# EAGLE board interfacez_r2_2 (EAGLE 6.4), part 1 of 2
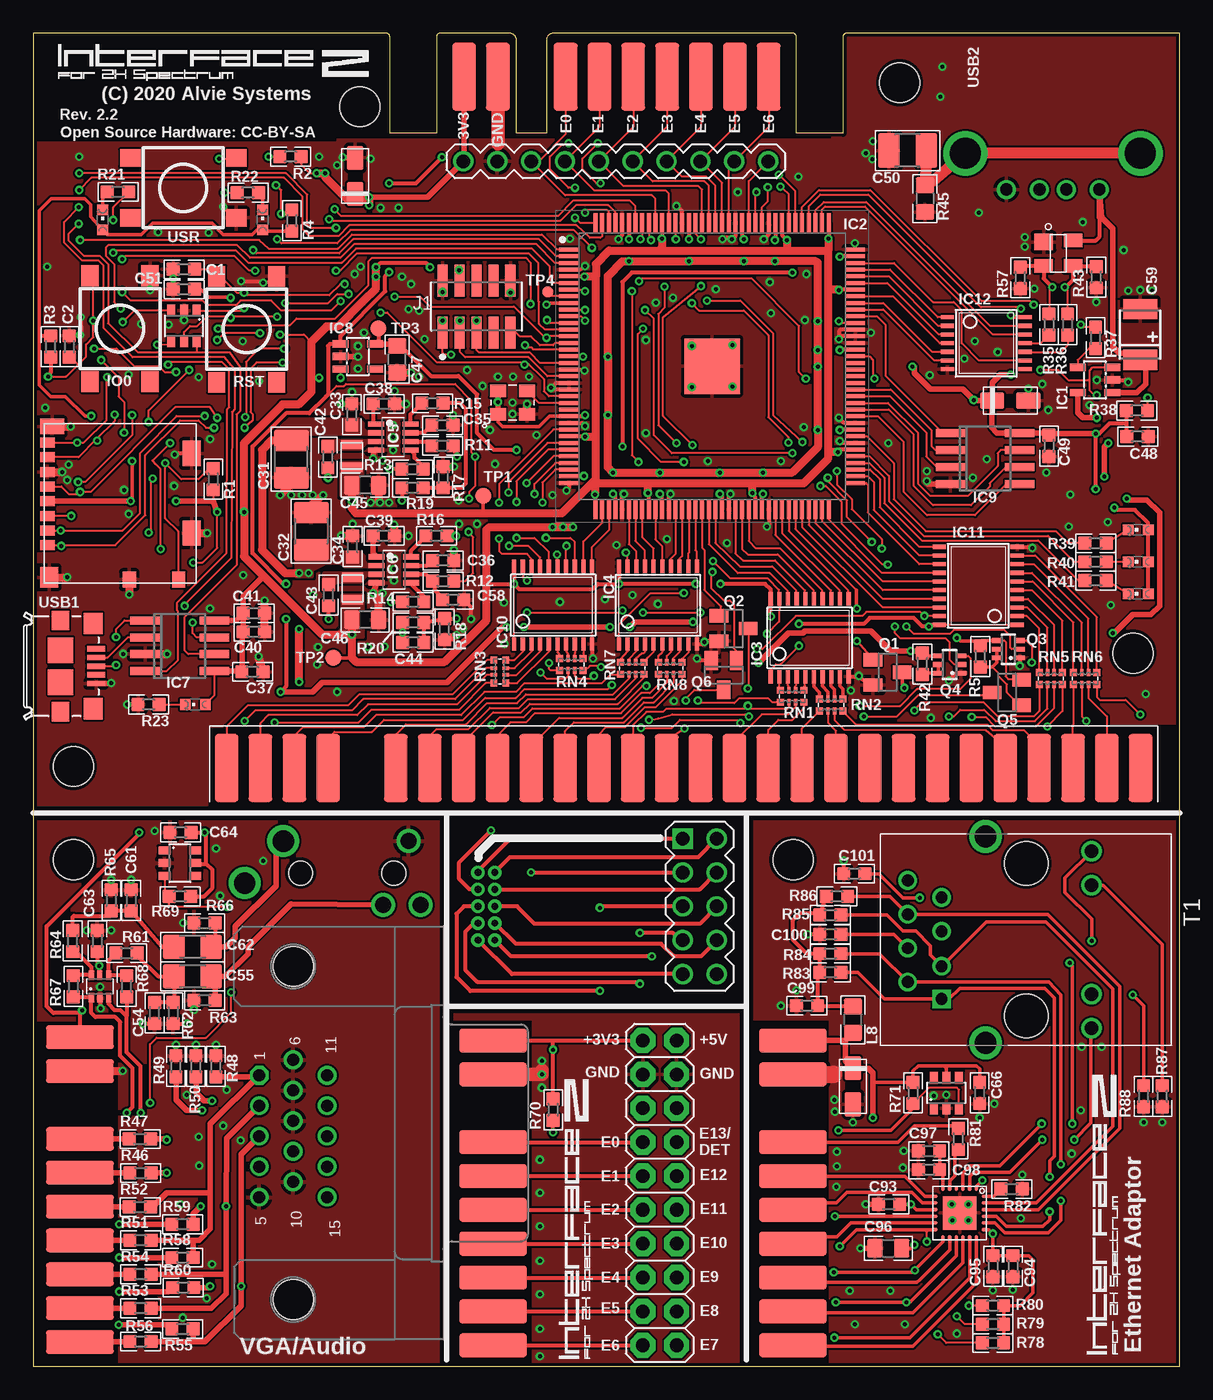
[diagram p9: board, top side]
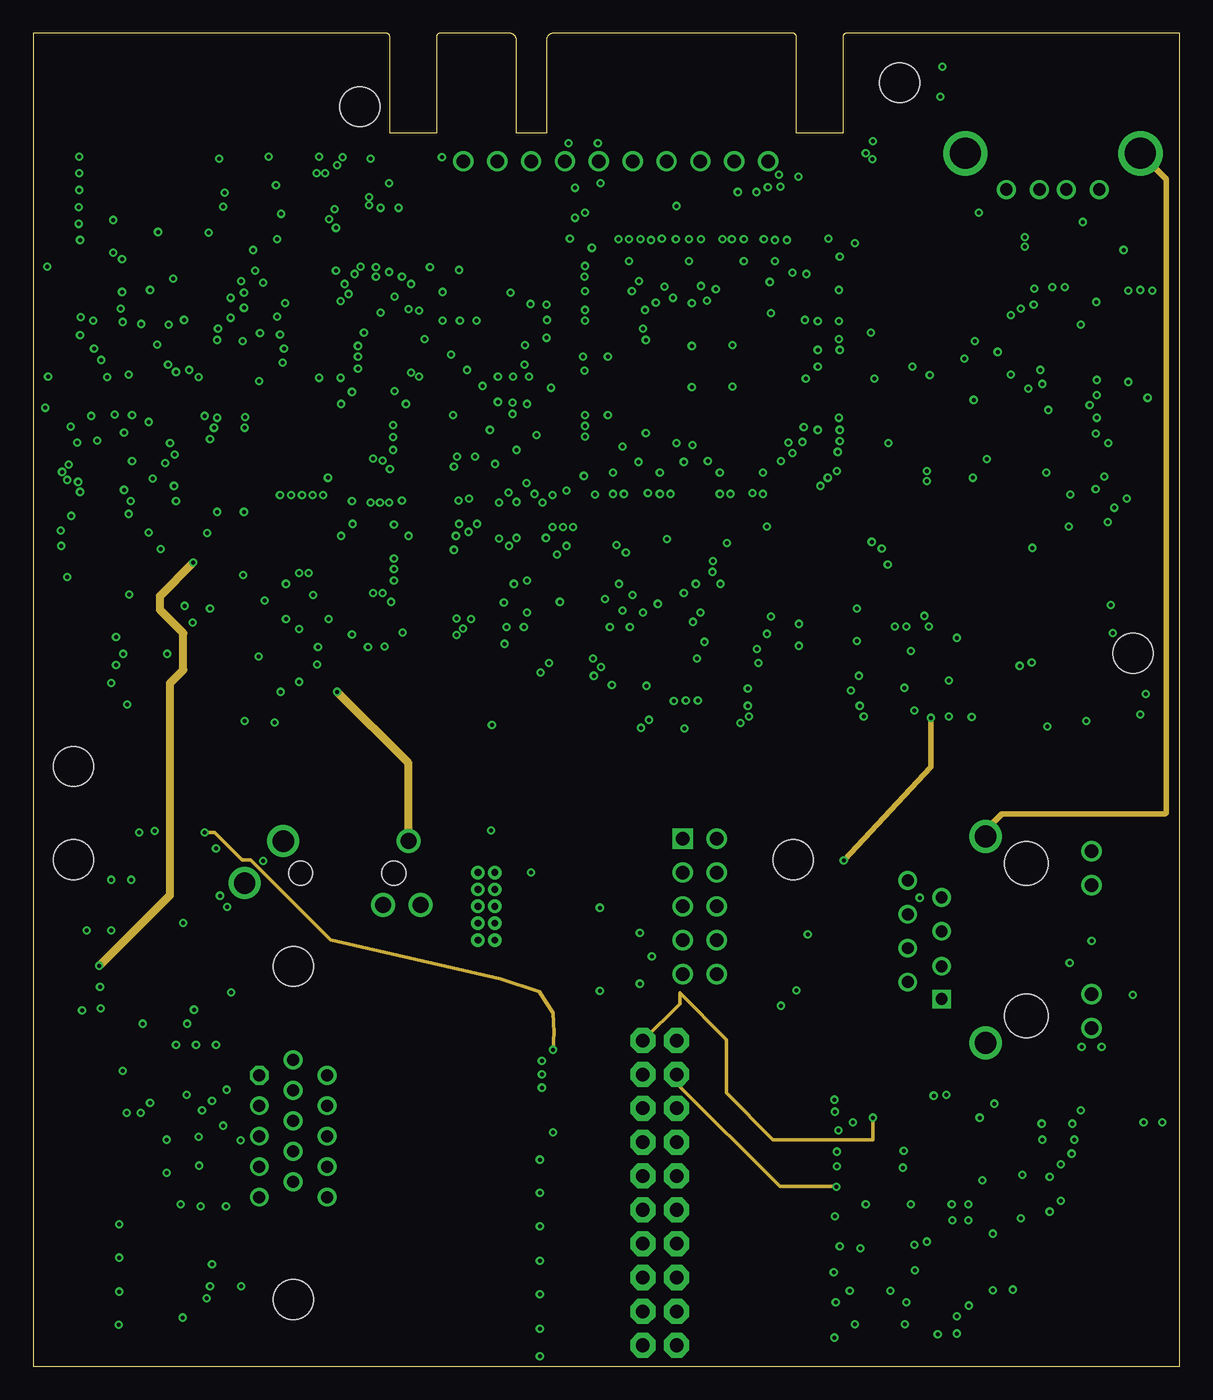
[diagram p10: board, inner layer Route2]
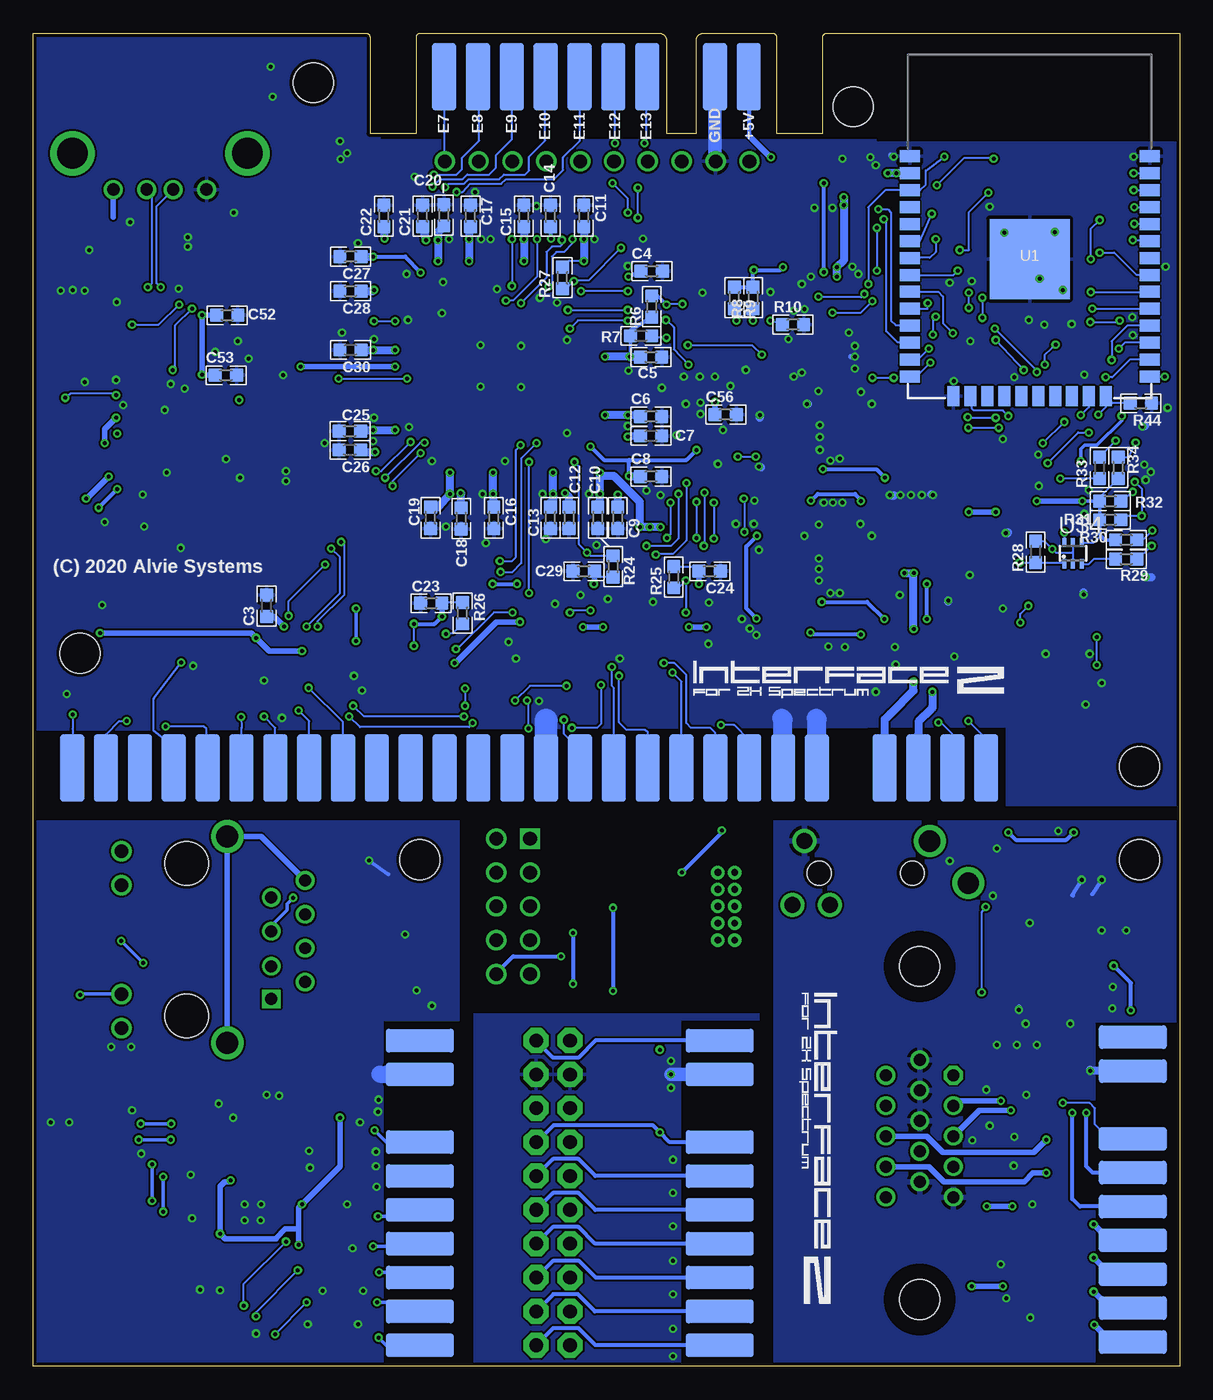
[diagram p11: board, bottom side, seen from below]

Size 86 x 100 mm. Coordinates in mm from the lower left corner, seen from the top.
Outline: 0,100 0,0 86,0 86,100 61,100 arc90 60.75,99.75 60.75,92.5 57.25,92.5 57.25,99.75 arc90 57,100 39,100 arc90 38.5,99.5 38.5,92.5 36.25,92.5 36.25,99.5 arc90 35.75,100 30.5,100 arc90 30.25,99.75 30.25,92.5 26.75,92.5 26.75,99.75 arc90 26.5,100 0,100
Copper layers (1*2*16): Top 0.035mm / dielectric 1.5mm / Route2 0.0175mm / dielectric 1.1mm / Bottom 0.035mm
Design rules "JLCPCB-Single-DualLayer *": minimum track width 5mil, minimum drill 0.3mm, track to track 6mil, track to pad 6mil, pad to pad 6mil, via to via 6mil, smd to smd 0mil, copper to edge 10mil, drill to drill 10mil, minimum pad ring 10mil, minimum via ring 6mil, stop-mask expansion 2mil, vias tented up to drill 100mil, thermal gap 10mil
Holes 3 mm at 3,45 82.5,53.5 24.5,94.5 65,96.3 3,38 57,38
tRestrict: area 30.5,0 to 31.5,41.5; area 0,41 to 86,42; area 30.5,0 to 31.5,41.5; area 53,0 to 54,41.5; area 31,26.5 to 53.5,27.5
bRestrict: area 30.5,0 to 31.5,41.5; area 0,41 to 86,42; area 30.5,0 to 31.5,41.5; area 53,0 to 54,41.5; area 31,26.5 to 53.5,27.5

## Footprints (pad centres in the part's own frame; a part is rotated, then mirrored left to right if it is on the bottom)
0603 = smd 1 x 1: 1 -0.8,0; 2 0.8,0
1210 = smd 1.6 x 2.6: 1 -1.4,0; 2 1.4,0
0805 = smd 1.2 x 1.4: 1 -1,0; 2 1,0
1206 = smd 1.6 x 1.8: 1 -1.4,0; 2 1.4,0
TANT_CASE_A = smd 1.8 x 1.23: MINUS 1.355,0; PLUS -1.355,0
TE-B-3528 = smd 1.524 x 2.54: + 1.905,0; - -1.905,0
ZX-EDGE-DAUGHTERBOARD = smd 1.778 x 5.08 bottom: A1 6.35,-1.27; A2 3.81,-1.27; A3 1.27,-1.27; A4 -1.27,-1.27; A6 -6.35,-1.27; A7 -8.89,-1.27; A8 -11.43,-1.27; A9 -13.97,-1.27; A10 -16.51,-1.27; A11 -19.05,-1.27; A12 -21.59,-1.27; A13 -24.13,-1.27; A14 -26.67,-1.27; A15 -29.21,-1.27; A16 -31.75,-1.27; A17 -34.29,-1.27; A18 -36.83,-1.27; A19 -39.37,-1.27; A20 -41.91,-1.27; A21 -44.45,-1.27; A22 -46.99,-1.27; A23 -49.53,-1.27; A24 -52.07,-1.27; A25 -54.61,-1.27; A26 -57.15,-1.27; A27 -59.69,-1.27; A28 -62.23,-1.27 | smd 1.778 x 5.08: B1 6.35,-1.27; B2 3.81,-1.27; B3 1.27,-1.27; B4 -1.27,-1.27; B6 -6.35,-1.27; B7 -8.89,-1.27; B8 -11.43,-1.27; B9 -13.97,-1.27; B10 -16.51,-1.27; B11 -19.05,-1.27; B12 -21.59,-1.27; B13 -24.13,-1.27; B14 -26.67,-1.27; B15 -29.21,-1.27; B16 -31.75,-1.27; B17 -34.29,-1.27; B18 -36.83,-1.27; B19 -39.37,-1.27; B20 -41.91,-1.27; B21 -44.45,-1.27; B22 -46.99,-1.27; B23 -49.53,-1.27; B24 -52.07,-1.27; B25 -54.61,-1.27; B26 -57.15,-1.27; B27 -59.69,-1.27; B28 -62.23,-1.27
SOT23-5L = smd 0.55 x 1.2: 1 -0.95,-1.3; 2 0,-1.3; 3 0.95,-1.3; 4 0.95,1.3; 5 -0.95,1.3
QFP50P2200X2200X165-145N = smd 1.475 x 0.3: 1 -10.738,8.75; 2 -10.738,8.25; 3 -10.738,7.75; 4 -10.738,7.25; 5 -10.738,6.75; 6 -10.738,6.25; 7 -10.738,5.75; 8 -10.738,5.25; 9 -10.738,4.75; 10 -10.738,4.25; 11 -10.738,3.75; 12 -10.738,3.25; 13 -10.738,2.75; 14 -10.738,2.25; 15 -10.738,1.75; 16 -10.738,1.25; 17 -10.738,0.75; 18 -10.738,0.25; 19 -10.738,-0.25; 20 -10.738,-0.75; 21 -10.738,-1.25; 22 -10.738,-1.75; 23 -10.738,-2.25; 24 -10.738,-2.75; 25 -10.738,-3.25; 26 -10.738,-3.75; 27 -10.738,-4.25; 28 -10.738,-4.75; 29 -10.738,-5.25; 30 -10.738,-5.75; 31 -10.738,-6.25; 32 -10.738,-6.75; 33 -10.738,-7.25; 34 -10.738,-7.75; 35 -10.738,-8.25; 36 -10.738,-8.75; 73 10.738,-8.75; 74 10.738,-8.25; 75 10.738,-7.75; 76 10.738,-7.25; 77 10.738,-6.75; 78 10.738,-6.25; 79 10.738,-5.75; 80 10.738,-5.25; 81 10.738,-4.75; 82 10.738,-4.25; 83 10.738,-3.75; 84 10.738,-3.25; 85 10.738,-2.75; 86 10.738,-2.25; 87 10.738,-1.75; 88 10.738,-1.25; 89 10.738,-0.75; 90 10.738,-0.25; 91 10.738,0.25; 92 10.738,0.75; 93 10.738,1.25; 94 10.738,1.75; 95 10.738,2.25; 96 10.738,2.75; 97 10.738,3.25; 98 10.738,3.75; 99 10.738,4.25; 100 10.738,4.75; 101 10.738,5.25; 102 10.738,5.75; 103 10.738,6.25; 104 10.738,6.75; 105 10.738,7.25; 106 10.738,7.75; 107 10.738,8.25; 108 10.738,8.75 | smd 0.3 x 1.475: 37 -8.75,-10.738; 38 -8.25,-10.738; 39 -7.75,-10.738; 40 -7.25,-10.738; 41 -6.75,-10.738; 42 -6.25,-10.738; 43 -5.75,-10.738; 44 -5.25,-10.738; 45 -4.75,-10.738; 46 -4.25,-10.738; 47 -3.75,-10.738; 48 -3.25,-10.738; 49 -2.75,-10.738; 50 -2.25,-10.738; 51 -1.75,-10.738; 52 -1.25,-10.738; 53 -0.75,-10.738; 54 -0.25,-10.738; 55 0.25,-10.738; 56 0.75,-10.738; 57 1.25,-10.738; 58 1.75,-10.738; 59 2.25,-10.738; 60 2.75,-10.738; 61 3.25,-10.738; 62 3.75,-10.738; 63 4.25,-10.738; 64 4.75,-10.738; 65 5.25,-10.738; 66 5.75,-10.738; 67 6.25,-10.738; 68 6.75,-10.738; 69 7.25,-10.738; 70 7.75,-10.738; 71 8.25,-10.738; 72 8.75,-10.738; 109 8.75,10.738; 110 8.25,10.738; 111 7.75,10.738; 112 7.25,10.738; 113 6.75,10.738; 114 6.25,10.738; 115 5.75,10.738; 116 5.25,10.738; 117 4.75,10.738; 118 4.25,10.738; 119 3.75,10.738; 120 3.25,10.738; 121 2.75,10.738; 122 2.25,10.738; 123 1.75,10.738; 124 1.25,10.738; 125 0.75,10.738; 126 0.25,10.738; 127 -0.25,10.738; 128 -0.75,10.738; 129 -1.25,10.738; 130 -1.75,10.738; 131 -2.25,10.738; 132 -2.75,10.738; 133 -3.25,10.738; 134 -3.75,10.738; 135 -4.25,10.738; 136 -4.75,10.738; 137 -5.25,10.738; 138 -5.75,10.738; 139 -6.25,10.738; 140 -6.75,10.738; 141 -7.25,10.738; 142 -7.75,10.738; 143 -8.25,10.738; 144 -8.75,10.738 | smd 4.15 x 4.15: 145 0,0
TSSOP20 = smd 0.305 x 0.991: 1 -2.925,-2.918; 2 -2.275,-2.918; 3 -1.625,-2.918; 4 -0.975,-2.918; 5 -0.325,-2.918; 6 0.325,-2.918; 7 0.975,-2.918; 8 1.625,-2.918; 9 2.275,-2.918; 10 2.925,-2.918; 11 2.925,2.918; 12 2.275,2.918; 13 1.625,2.918; 14 0.975,2.918; 15 0.325,2.918; 16 -0.325,2.918; 17 -0.975,2.918; 18 -1.625,2.918; 19 -2.275,2.918; 20 -2.925,2.918
SOT23-8L = smd 0.4 x 1.2: 1 -0.975,-1.3; 2 -0.325,-1.3; 3 0.325,-1.3; 4 0.975,-1.3; 5 0.975,1.3; 6 0.325,1.3; 7 -0.325,1.3; 8 -0.975,1.3
SOIC8 = smd 0.6 x 2.2: 1 -1.905,-2.6; 2 -0.635,-2.6; 3 0.635,-2.6; 4 1.905,-2.6; 5 1.905,2.6; 6 0.635,2.6; 7 -0.635,2.6; 8 -1.905,2.6
TSSOP14 = smd 0.305 x 0.991: 1 -1.95,-2.918; 2 -1.3,-2.918; 3 -0.65,-2.918; 4 0,-2.918; 5 0.65,-2.918; 6 1.3,-2.918; 7 1.95,-2.918; 8 1.95,2.918; 9 1.3,2.918; 10 0.65,2.918; 11 0,2.918; 12 -0.65,2.918; 13 -1.3,2.918; 14 -1.95,2.918
SC70-6 = smd 0.4 x 0.7: 1 -0.65,-0.85; 2 0,-0.85; 3 0.65,-0.85; 4 0.65,0.85; 5 -0.015,0.85; 6 -0.65,0.85
QFN24_4MM_X_4MM = smd 0.4 x 0.25: 1 -1.86,1.25; 2 -1.86,0.75; 3 -1.86,0.25; 4 -1.86,-0.25; 5 -1.86,-0.75; 6 -1.86,-1.25; 13 1.86,-1.25; 14 1.86,-0.75; 15 1.86,-0.25; 16 1.86,0.25; 17 1.86,0.75; 18 1.86,1.25 | smd 0.25 x 0.4: 7 -1.25,-1.86; 8 -0.75,-1.86; 9 -0.25,-1.86; 10 0.25,-1.86; 11 0.75,-1.86; 12 1.25,-1.86; 19 1.25,1.86; 20 0.75,1.86; 21 0.25,1.86; 22 -0.25,1.86; 23 -0.75,1.86; 24 -1.25,1.86 | smd 2.5 x 2.5: P 0,0
AMPHENOL_ICC_-_FCI_20021121-00010C4LF_0 = smd 0.76 x 2.4: 1 -2.54,-1.95; 2 -2.54,1.95; 3 -1.27,-1.95; 4 -1.27,1.95; 5 0,-1.95; 6 0,1.95; 7 1.27,-1.95; 8 1.27,1.95; 9 2.54,-1.95; 10 2.54,1.95
2X10 = drill 1.016 pad 1.88 octagon: 1 -11.43,-1.27; 2 -11.43,1.27; 3 -8.89,-1.27; 4 -8.89,1.27; 5 -6.35,-1.27; 6 -6.35,1.27; 7 -3.81,-1.27; 8 -3.81,1.27; 9 -1.27,-1.27; 10 -1.27,1.27; 11 1.27,-1.27; 12 1.27,1.27; 13 3.81,-1.27; 14 3.81,1.27; 15 6.35,-1.27; 16 6.35,1.27; 17 8.89,-1.27; 18 8.89,1.27; 19 11.43,-1.27; 20 11.43,1.27
IND_0806 = smd 0.7 x 1.6: P$1 -0.85,0; P$2 0.85,0
LED-603 = smd 0.8 x 0.8: A 0,-0.75; C 0,0.75
SOT23 = smd 1 x 1.4: 1 -0.95,-1.1; 2 0.95,-1.1; 3 0,1.1
SC70-6' = smd 0.35 x 0.8: 1 -0.65,-0.85; 2 0,-0.85; 3 0.65,-0.85; 4 0.65,0.85; 5 0,0.85; 6 -0.65,0.85
EXB28V = smd 0.525 x 0.5: 1 -0.875,-0.45; 4 0.875,-0.45; 5 0.875,0.45; 8 -0.875,0.45 | smd 0.25 x 0.5: 2 -0.25,-0.45; 3 0.25,-0.45; 6 0.25,0.45; 7 -0.25,0.45
TACTILE_SWITCH_TALL = smd 1.55 x 1.3: A1 -3.975,-2.25; A2 3.975,-2.25; B1 -3.975,2.25; B2 3.975,2.25
1040310811 = smd 0.75 x 1.1: 1 3.155,-5.45; 2 2.055,-5.45; 3 0.955,-5.45; 4 -0.145,-5.45; 5 -1.245,-5.45; 6 -2.345,-5.45; 7 -3.445,-5.45; 8 -4.545,-5.45 | smd 1.2 x 1: A 5.74,4.4; B 5.74,0.7 | smd 1.9 x 1.35: MNT1 -3.73,5.375; MNT2 2.24,5.375 | smd 1.17 x 1.8: MNT3 -5.755,-5.1 | smd 1.55 x 1.35: MNT4 5.565,-5.325
HR13550A = drill 0.89 square: 1 4.45,-6.35 | drill 0.89: 2 3.18,-8.89; 3 2,-6.35; 4 0.64,-8.89; 5 -0.63,-6.35; 6 -1.9,-8.89; 7 -3.17,-6.35; 8 -4.44,-8.89 | drill 1.02: 9 6.625,4.9; 10 4.085,4.9; 11 -4.085,4.9; 12 -6.625,4.9 | drill 1.63: Z1 -7.745,-3.05; Z2 7.745,-3.05 | hole 3.25: -5.715,0; 5.715,0
TP12R = smd 1.2 x 1.2: TP 0,0
TP08R = smd 0.8 x 0.8: TP 0,0
SP0503 = smd 1.2 x 1.4: 1 -0.85,-1.1 | smd 1 x 1.4: 2 0.95,-1.1; 3 0.95,1.1; 4 -0.95,1.1
ESP-WROOM-32 = smd 0.9 x 1.5: 1 7.7,9; 2 6.43,9; 3 5.16,9; 4 3.89,9; 5 2.62,9; 6 1.35,9; 7 0.08,9; 8 -1.19,9; 9 -2.46,9; 10 -3.73,9; 11 -5,9; 12 -6.27,9; 13 -7.54,9; 14 -8.81,9; 25 -8.81,-9; 26 -7.54,-9; 27 -6.27,-9; 28 -5,-9; 29 -3.73,-9; 30 -2.46,-9; 31 -1.19,-9; 32 0.08,-9; 33 1.35,-9; 34 2.62,-9; 35 3.89,-9; 36 5.16,-9; 37 6.43,-9; 38 7.7,-9 | smd 1.5 x 0.9: 15 -10.3,5.715; 16 -10.3,4.445; 17 -10.3,3.175; 18 -10.3,1.905; 19 -10.3,0.635; 20 -10.3,-0.635; 21 -10.3,-1.905; 22 -10.3,-3.175; 23 -10.3,-4.445; 24 -10.3,-5.715 | smd 6 x 6: GND 0,0
KC3225K = smd 1.2 x 0.95: 1 -1.1,-0.875; 2 1.1,-0.875; 3 1.1,0.875; 4 -1.1,0.875
INTERFACEZ_EXPANSION_DAUGHTERCARD = smd 1.778 x 5.08 bottom: A1 11.43,0; A2 8.89,0; A4 3.81,0; A5 1.27,0; A6 -1.27,0; A7 -3.81,0; A8 -6.35,0; A9 -8.89,0; A10 -11.43,0 | smd 1.778 x 5.08: B1 11.43,0; B2 8.89,0; B4 3.81,0; B5 1.27,0; B6 -1.27,0; B7 -3.81,0; B8 -6.35,0; B9 -8.89,0; B10 -11.43,0
SOT23-6 = smd 0.6 x 0.9: 1 -0.95,-1.15; 2 0,-1.15; 3 0.95,-1.15; 4 0.95,1.15; 5 0,1.15; 6 -0.95,1.15
SOT363_INFINEON = smd 0.3 x 0.7: 1 -0.65,-0.8; 2 0,-0.8; 3 0.65,-0.8; 4 0.65,0.8; 5 0,0.8; 6 -0.65,0.8
PIN-1X10 = drill 1.016: 1 -11.43,0; 2 -8.89,0; 3 -6.35,0; 4 -3.81,0; 5 -1.27,0; 6 1.27,0; 7 3.81,0; 8 6.35,0; 9 8.89,0; 10 11.43,0
PJ328A0 = drill 1.2: 1 -4.95,-2.4; 3 -3.05,2.4; 11 -5.85,2.4 | drill 1.6: 2 4.45,-2.4; 10 7.35,0.75 | hole 1.8: -3.85,0; 3.15,0
PIN-2X5-1.27 = drill 0.5: 1 -2.54,-0.635; 2 -2.54,0.635; 3 -1.27,-0.635; 4 -1.27,0.635; 5 0,-0.635; 6 0,0.635; 7 1.27,-0.635; 8 1.27,0.635; 9 2.54,-0.635; 10 2.54,0.635
PIN-2X5 = drill 1.016 square: 1 -5.08,-1.27 | drill 1.016: 2 -5.08,1.27; 3 -2.54,-1.27; 4 -2.54,1.27; 5 0,-1.27; 6 0,1.27; 7 2.54,-1.27; 8 2.54,1.27; 9 5.08,-1.27; 10 5.08,1.27
CONN_USB_MICRO-B = smd 1.6 x 1.4: BODY@1 -3.2,2.45; BODY@2 3.2,2.45 | smd 1.45 x 1.3: BODY@3 3.425,0; BODY@6 -3.425,0 | smd 1.9 x 1.9: BODY@4 1.2,0; BODY@5 -1.2,0 | smd 0.4 x 1.35: P1 -1.3,2.675; P2 -0.65,2.675; P3 0,2.675; P4 0.65,2.675; P5 1.3,2.675
USB-A-H = drill 0.914: D+ 2.718,-1.003; D- 2.718,1.003; GND 2.718,-3.493; VBUS 2.718,3.493 | drill 2.311: P$5 0,-6.566; P$6 0,6.566
HDF15H = drill 0.9 octagon: 1 4.329,2.54 | drill 0.9: 2 2.043,2.54; 3 -0.243,2.54; 4 -2.529,2.54; 5 -4.815,2.54; 6 5.472,0; 7 3.186,0; 8 0.9,0; 9 -1.386,0; 10 -3.672,0; 11 4.329,-2.54; 12 2.043,-2.54; 13 -0.243,-2.54; 14 -2.529,-2.54; 15 -4.815,-2.54 | hole 3: -12.5,0; 12.5,0

## Placement (x,y rotation side)
C1  1nF  [0603]  11.3,82.3 0 top
C2  1nF  [0603]  2.7,76.5 270 top
C3  100nF 6.3V  [0603]  68.5,57.05 90 bottom
C4  100nF 6.3V  [0603]  39.6,82.15 0 bottom
C5  100nF 6.3V  [0603]  39.65,75.7 0 bottom
C6  100nF 6.3V  [0603]  39.65,71.25 0 bottom
C7  100nF 6.3V  [0603]  39.65,69.8 0 bottom
C8  100nF 6.3V  [0603]  39.65,66.75 0 bottom
C9  100nF 6.3V  [0603]  42.15,63.65 270 bottom
C10  100nF 6.3V  [0603]  43.65,63.65 270 bottom
C11  100nF 6.3V  [0603]  44.7,86.3 90 bottom
C12  100nF 6.3V  [0603]  45.8,63.65 270 bottom
C13  100nF 6.3V  [0603]  47.2,63.65 270 bottom
C14  100nF 6.3V  [0603]  47.2,86.3 90 bottom
C15  100nF 6.3V  [0603]  49.2,86.3 90 bottom
C16  100nF 6.3V  [0603]  51.45,63.65 270 bottom
C17  100nF 6.3V  [0603]  53.2,86.3 90 bottom
C18  100nF 6.3V  [0603]  53.9,63.6 270 bottom
C19  100nF 6.3V  [0603]  56.2,63.65 270 bottom
C20  100nF 6.3V  [0603]  55.2,86.35 90 bottom
C21  100nF 6.3V  [0603]  56.8,86.3 90 bottom
C22  100nF 6.3V  [0603]  59.7,86.3 90 bottom
C23  100nF 6.3V  [0603]  56.15,57.25 180 bottom
C24  100nF 6.3V  [0603]  35.25,59.65 0 bottom
C25  100nF 6.3V  [0603]  62.25,70.15 180 bottom
C26  100nF 6.3V  [0603]  62.25,68.75 180 bottom
C27  100nF 6.3V  [0603]  62.2,83.25 180 bottom
C28  100nF 6.3V  [0603]  62.2,80.65 180 bottom
C29  100nF 6.3V  [0603]  44.7,59.65 180 bottom
C30  100nF 6.3V  [0603]  62.2,76.25 180 bottom
C31  22uF 16V  [1210]  19.35,68.05 90 top
C32  22uF 16V  [1210]  20.85,62.65 270 top
C33  100nF 16V  [0603]  23.9,71.4 270 top
C34  100nF 16V  [0603]  23.95,61.5 270 top
C35  100nF 16V  [0603]  30.7,70.6 180 top
C36  100nF 16V  [0603]  30.75,60.45 180 top
C37  1uF  [0603]  16.45,52.1 0 top
C38  22nF 6.3V  [0603]  26.3,72.2 180 top
C39  22nF 6.3V  [0603]  26.3,62.3 180 top
C40  10uF  [0603]  16.55,55.1 0 top
C41  100nF 6.3V  [0603]  16.55,56.5 0 top
C42  100nF 6.3V  [0603]  22.1,68.2 270 top
C43  100nF 6.3V  [0603]  22.15,57.85 270 top
C44  15pF  [0603]  28.5,54.3 180 top
C45  22uF 6.3V TBD  [0805]  24.9,66.1 180 top
C46  22uF 6.3V TBD  [0805]  24.9,56 180 top
C47  10uF 6.3V TBD  [0805]  27.3,75.55 90 top
C48  100nF 6.3V  [0603]  82.85,69.75 180 top
C49  100nF 6.3V  [0603]  76.2,69.05 90 top
C50  1000pF 2KV  [1210]  65.6,91.2 180 top
C51  100nF 6.3V  [0603]  11.3,80.8 0 top
C52  100nF 6.3V  [0603]  71.45,78.85 0 bottom
C53  100nF 6.3V  [0603]  71.55,74.35 0 bottom
C54  100nF  [0603]  9.1,26.5 90 top
C55  47uF  [1206]  11.95,29.25 0 top
C56  100nF 6.3V  [0603]  34.05,71.4 0 bottom
C57  47uF 6.3V TANT  [TANT_CASE_A]  24.15,89.3 90 top
C58  100nF/DNP  [0603]  31.5,57.5 180 top
C59  TAJB107M010RNJ  [TE-B-3528]  83.05,77.4 270 top
C60  47uF 6.3V TANT  [TANT_CASE_A]  73.3,72.45 0 top
C61  100nF  [0603]  7.35,34.95 270 top
C62  47uF  [1206]  11.95,31.45 0 top
C63  100nF  [0603]  4.8,31.9 270 top
C64  100nF 6.3V  [0603]  11.05,40.05 0 top
C65  47uF 6.3V TANT  [TANT_CASE_A]  61.5,21 270 top
C66  100nF 6.3V  [0603]  71,20.5 90 top
C93  100nF  [0603]  64.2,12.15 0 top
C94  100nF  [0603]  73.5,7.5 90 top
C95  100nF  [0603]  72,7.5 90 top
C96  2.2uF  [0805]  64.15,8.85 0 top
C97  1uF  [0603]  67.2,16.15 0 top
C98  1nF  [0603]  67.2,14.75 0 top
C99  100nF/DNP  [0603]  58.05,27.05 0 top
C100  100nF  [0603]  59.8,32.4 180 top
C101  100nF  [0603]  61.6,36.95 180 top
CONN1  ZX_EDGE_DAUGHTERBOARD  [ZX-EDGE-DAUGHTERBOARD]  20.86,43.6 180 top
IC1  STMPS2141STR  [SOT23-5L]  79.65,74 90 top
IC2  EP4CE6E22C8N  [QFP50P2200X2200X165-145N]  50.92,75.02 0 top
IC3  74LCX245FT  [TSSOP20]  58.25,54.65 0 top
IC4  74LCX245FT  [TSSOP20]  46.87,57.09 0 top
IC5  MP2233DJ  [SOT23-8L]  27,69.7 270 top
IC6  MP2233DJ  [SOT23-8L]  27.05,59.75 270 top
IC7  CH330N  [SOIC8]  10.98,54.05 270 top
IC8  MIC5504-2.5YM5-TR  [SOT23-5L]  24.35,75.75 270 top
IC9  LY68L6400SLIT  [SOIC8]  71.4,68.1 270 top
IC10  74LCX245FT  [TSSOP20]  39,57.1 0 top
IC11  74LCX245FT  [TSSOP20]  70.9,58.55 90 top
IC12  USB1T11AMTCX  [TSSOP14]  71.5,76.75 270 top
IC13  NC7WZ16P6X  [SC70-6]  5,28.5 0 top
IC14  LAN8720A  [QFN24_4MM_X_4MM]  69.5,11.5 270 top
J1  AMPHENOL_ICC_-_FCI_20021121-00010C4LFAMPHENOL_ICC_-_FCI_20021121-00010C4LF_0_0  [AMPHENOL_ICC_-_FCI_20021121-00010C4LF_0]  33.25,79.5 0 top
JP1  [2X10]  47,13 270 top
L1  VLS201610HBXR68-M1  [IND_0806]  23.9,68.3 270 top
L2  VLS201610HBX1R5-M1  [IND_0806]  23.95,58.35 270 top
L8  600R  [0805]  61.5,26 90 top
LED1  LG L29K-G2J1-24  [LED-603]  5.2,86 0 top
LED2  LG L29K-G2J1-24  [LED-603]  17.2,86 0 top
LED3  LG L29K-G2J1-24  [LED-603]  12.15,49.65 90 top
LED4  LG L29K-G2J1-24  [LED-603]  82.9,62.75 90 top
LED5  LG L29K-G2J1-24  [LED-603]  82.9,60.35 90 top
LED6  LG L29K-G2J1-24  [LED-603]  82.9,57.95 90 top
Q1  BSS123  [SOT23]  64.09,52.06 270 top
Q2  BSS123  [SOT23]  52.54,55.34 270 top
Q3  CJ3439KDW  [SC70-6']  73.15,53.8 90 top
Q4  CJ3439KDW  [SC70-6']  68.75,52.65 90 top
Q5  BSS84  [SOT23]  73.05,50.55 90 top
Q6  BSS123  [SOT23]  51.8,51.85 180 top
R1  10K  [0603]  13.5,66.55 90 top
R2  10K  [0603]  19.3,90.75 0 top
R3  10K  [0603]  1.3,76.5 90 top
R4  10K  [0603]  19.4,85.95 270 top
R5  10K  [0603]  71.05,53.25 270 top
R6  10K  [0603]  39.6,79.5 270 bottom
R7  10K  [0603]  40.4,77.3 180 bottom
R8  10K  [0603]  32,80.15 90 bottom
R9  10K  [0603]  33.4,80.15 90 bottom
R10  10K  [0603]  29,78.15 0 bottom
R11  140K  [0603]  30.7,69.05 0 top
R12  140K  [0603]  30.75,58.9 0 top
R13  20R  [0603]  28.45,67.3 0 top
R14  20R  [0603]  28.5,57.35 0 top
R15  140K  [0603]  29.95,72.25 0 top
R16  24K  [0603]  30.25,62.3 0 top
R17  61K9  [0603]  30.75,66.7 270 top
R18  13K  [0603]  30.85,55.3 90 top
R19  30K1  [0603]  28.45,65.9 180 top
R20  40K2  [0603]  28.5,55.8 180 top
R21  2K2  [0603]  6.35,88.1 0 top
R22  2K2  [0603]  16.1,88.05 180 top
R23  2K2  [0603]  8.65,49.65 180 top
R24  100K  [0603]  42.5,60 90 bottom
R25  100K  [0603]  37.95,59.2 270 bottom
R26  100K  [0603]  53.8,56.5 270 bottom
R27  10K  [0603]  46.3,81.65 90 bottom
R28  10K  [0603]  10.8,61.1 90 bottom
R29  10K  [0603]  4,60.55 0 bottom
R30  10K  [0603]  4,62 180 bottom
R31  10K  [0603]  5.2,63.5 180 bottom
R32  10K  [0603]  5.2,64.9 180 bottom
R33  10K  [0603]  6,67.4 90 bottom
R34  10K  [0603]  4.6,67.4 270 bottom
R35  33R  [0603]  76.2,78.15 90 top
R36  33R  [0603]  77.6,78.15 90 top
R37  100R  [0603]  79.7,77.15 90 top
R38  100K  [0603]  82.8,71.7 180 top
R39  2K2  [0603]  79.7,61.75 180 top
R40  2K2  [0603]  79.7,60.35 180 top
R41  2K2  [0603]  79.7,58.95 180 top
R42  10K  [0603]  66.7,52.7 270 top
R43  15K  [0603]  79.75,81.7 90 top
R44  470K/DNP  [0603]  2.9,72.25 180 bottom
R45  1M  [0805]  66.9,87.6 270 top
R46  82R5  [0603]  8.05,14.5 0 top
R47  82R5  [0603]  8,17.05 0 top
R48  130R  [0603]  13.7,22.5 270 top
R49  130R  [0603]  12.2,22.5 270 top
R50  130R  [0603]  10.7,22.5 270 top
R51  1K24  [0603]  8.05,9.45 0 top
R52  619R  [0603]  8,11.95 0 top
R53  1K24  [0603]  8.05,4.35 0 top
R54  619R  [0603]  8.05,6.9 0 top
R55  1K24  [0603]  11.2,2.8 0 top
R56  619R  [0603]  8.05,1.85 0 top
R57  15K  [0603]  74.05,81.65 90 top
R58  309R  [0603]  11.2,8.15 0 top
R59  309R  [0603]  11.2,10.65 0 top
R60  309R  [0603]  11.25,5.9 0 top
R61  220R  [0603]  7,31 180 top
R62  100R  [0603]  10.5,26.5 270 top
R63  1K8  [0603]  12.85,27.45 180 top
R64  220R  [0603]  2.95,31.9 270 top
R65  100R  [0603]  5.85,34.95 90 top
R66  1K8  [0603]  12.85,33.25 180 top
R67  0R/DNP  [0603]  3,28.5 90 top
R68  0R/DNP  [0603]  7,28.5 90 top
R69  2K2  [0603]  11,35.25 0 top
R70  2K2  [0603]  39,19.25 90 top
R71  2K2  [0603]  66,20.5 90 top
R78  10K  [0603]  72,1.75 0 top
R79  2K2  [0603]  72,3.15 0 top
R80  2K2  [0603]  72,4.55 0 top
R81  0R  [0603]  69.4,17.05 270 top
R82  12K1  [0603]  73.4,13.3 180 top
R83  49R9  [0603]  59.8,29.55 180 top
R84  49R9  [0603]  59.8,30.95 180 top
R85  49R9  [0603]  59.8,33.85 180 top
R86  49R9  [0603]  60.3,35.25 180 top
R87  330R  [0603]  84.7,20.25 90 top
R88  330R  [0603]  83.3,20.25 90 top
RN1  330R  [EXB28V]  56.94,50.26 0 top
RN2  330R  [EXB28V]  59.87,49.61 0 top
RN3  330R  [EXB28V]  34.99,52.12 270 top
RN4  330R  [EXB28V]  40.37,52.65 0 top
RN5  330R  [EXB28V]  76.34,51.6 0 top
RN6  330R  [EXB28V]  78.92,51.6 0 top
RN7  33R  [EXB28V]  44.95,52.35 0 top
RN8  33R  [EXB28V]  47.78,52.35 0 top
S1  SWITCHES_SMD-4  [TACTILE_SWITCH_TALL]  16,77.8 90 top
S2  SWITCHES_SMD-4  [TACTILE_SWITCH_TALL]  6.5,77.85 90 top
S3  SWITCHES_SMD-4  [TACTILE_SWITCH_TALL]  11.25,88.4 0 top
SD1  1040310811  [1040310811]  6.5,64.75 270 top
T1  Hanrun HR917550A  [HR13550A]  74.5,32 270 top
TP1  TPTP12R  [TP12R]  33.75,65.3 0 top
TP2  TPTP12R  [TP12R]  22.5,53.15 0 top
TP3  TPTP12R  [TP12R]  25.9,77.85 0 top
TP4  TPTP08R  [TP08R]  38.6,80.6 0 top
TV26  SP0503BAHT  [SP0503]  76.9,83.5 270 top
U1  ESP-WROOM-32  [ESP-WROOM-32]  11.24,83.06 90 bottom
U$1  KC3225K-32MHz  [KC3225K]  35.95,72.3 0 top
U$2  INTERFACEZ_EDGEDAUGHTER  [INTERFACEZ_EXPANSION_DAUGHTERCARD]  34.5,13 90 top
U$3  PMS150C-U06  [SOT23-6]  11.3,78.05 180 top
U$4  BSS84DW  [SOT363_INFINEON]  8,61 0 bottom
U$5  INTERFACEZ_EDGEDAUGHTER  [INTERFACEZ_EXPANSION_DAUGHTERCARD]  43.75,96.75 180 top
U$6  PMS150C-U06  [SOT23-6]  11,37.75 270 top
U$7  PIN-1X10  [PIN-1X10]  43.7,90.4 0 top
U$8  INTERFACEZ_EDGEDAUGHTER  [INTERFACEZ_EXPANSION_DAUGHTERCARD]  3.5,13.25 90 top
U$9  PJ328-A0  [PJ328A0]  23.2,37 180 top
U$10  INTERFACEZ_EDGEDAUGHTER  [INTERFACEZ_EXPANSION_DAUGHTERCARD]  57,13 90 top
U$11  PMS150C-U06  [SOT23-6]  68.5,20.5 0 top
U$12  [LOGO-20]  41.95,0.55 90 top
U$13  [LOGO-20]  81.55,0.9 90 top
U$14  [LOGO-23-2.65]  28.5,28 270 bottom
U$15  PIN-2X5-1.27MM  [PIN-2X5-1.27]  34,34.5 270 top
U$16  PIN-2X5  [PIN-2X5]  50,34.5 270 top
USB1  CON-USB-F-MICRO-B  [CONN_USB_MICRO-B]  2.04,52.52 270 top
USB2  USB-A-H  [USB-A-H]  76.5,91 270 top
X1  [HDF15H]  19.5,17.5 90 top

## Tracks (layer width: path | path; a pad name or v marks a point on that pad's centre or on a via)
+1V2  (via drill 0.3)
  Top 0.254: TP1.TP 33.75,64
  Top 0.305: R19.2 v27.65,64.95 | v23.9,64.9 C45.2 | IC2.61 54.17,65.17 v53.95,65.5 | IC2.45 46.17,65.42 v46.1,65.5 | IC2.37 42.17,65.42 v42.15,65.4 | 42.25,66.25 42.17,66.12 42.2,66.55 | 53.95,66.1 53.9,66.25 | IC2.78 60.52,68.77 v60.35,68.6 | IC2.102 60.47,80.77 v60.45,80.75 | 59.73,80.77 59.65,80.8 | 59.75,68.6 59.65,68.55 | IC2.29 41.27,69.77 v41.4,69.75 | IC2.5 41.23,81.77 v41.35,81.75 | IC2.134 47.17,84.72 v47.15,84.6 | 47.15,83.95 47.05,83.7 | IC2.116 56.17,84.88 v56.55,84.5 | IC2.109 59.67,84.62 v59.65,84.6
  Top 0.61: 42.25,66.25 46.1,66.25 | 46.1,66.25 53.9,66.25 57.8,66.25 59.65,68.1 59.65,68.55 59.65,80.8 59.65,83.7 | v46.1,65.5 46.1,66.25 | v53.95,65.5 53.95,66.1 | 60.47,80.77 59.73,80.77 | v60.35,68.6 59.75,68.6 | 42.2,69.75 42.2,66.55 39.65,64 33.75,64 24.2,64 23.9,64.35 C45.2 | 42.2,69.75 42.2,81.75 | v41.4,69.75 42.2,69.75 | 42.2,81.75 42.2,82.7 43.2,83.7 47.05,83.7 56.55,83.7 | 42.2,81.75 v41.35,81.75 | 56.55,83.7 59.65,83.7 | v47.15,84.6 47.15,83.95 | v56.55,84.5 56.55,83.7 | v59.65,84.6 59.65,83.7 | 42.17,65.42 42.17,66.12
  Bottom 0.305: v27.65,64.95 27.15,65.45 24.35,65.45 23.85,64.95 v23.9,64.9 | v53.95,65.5 54.05,65.45 | v46.1,65.5 45.95,65.5 | v42.15,65.4 42.3,65.45 | v60.35,68.6 60.35,68.7 | v41.4,69.75 41.25,69.75 | C4.1 41.2,81.8 v41.35,81.75 | v47.15,84.6 47.15,85.45 C14.1 | 59.65,85.45 C22.1
  Bottom 0.61: v59.65,84.6 59.65,85.45 | C12.1 45.8,65.2 v46.1,65.5 | C18.1 53.9,65.5 v53.95,65.5 | C9.1 v42.15,65.4 | C7.1 v41.4,69.75 | C26.1 61.25,68.75 61.1,68.6 v60.35,68.6 | C28.1 60.55,80.65 v60.45,80.75 | C21.1 56.65,84.85 v56.55,84.5
  pour Top (no thermals): 24.7,67.8 24.7,65.3 23.1,65.3 23.1,67.8
+2V5  (via drill 0.3)
  Top 0.305: IC2.107 60.52,83.27 v60.5,83.25 | v56.95,82.05 44.9,82.05 44.2,81.35 v44.2,69 | IC2.35 41.33,66.77 v41.3,66.8 | v36.25,68.75 34.55,68.75 33.3,70 33.3,72.9 31.9,74.3 29.85,74.3 27.6,76.55 C47.2 | TP3.TP 25.9,76.95 IC8.5
  Top 0.406: IC8.5 27.35,76.7 C47.2
  Bottom 0.305: v60.5,83.25 58.1,83.25 v56.95,82.05 | 41.3,68 37,68 v36.25,68.75 | v41.3,66.8 41.3,68 | v44.2,69 43.2,68 41.3,68
  Bottom 0.61: C27.1 v60.5,83.25 | C8.1 41.25,66.75 v41.3,66.8
+3V3  (via drill 0.3)
  Top 0.152: IC2.97 60.53,78.27 v60.45,78.4 | C30.1 v60.5,76.25 | R1.1 13.5,64.9 | R2.2 20.1,90.14 20.74,89.5 v21.89,89.5 v21.9,89.5 | IC11.1 IC11.20 | IC3.1 55.33,52.27 55.7,52.65 56.05,52.65 v57.45,54.05 | IC10.1 36.08,58.67 v36.05,58.7 | v12,60.3 12.7,60.3 13.8,61.4 v13.8,64.1 | IC7.5 13.58,50.33 LED3.A | IC8.3 v23.05,74.15 | v21.45,74.15 20.85,74.15 | U$3.5 11.3,77.6 11.75,78.05 12.3,78.05 13.05,78.8 14.8,78.8 | 14.8,78.8 18.2,78.8 v18.3,78.75 | v18.5,77.4 20.3,77.4 20.85,76.85 | J1.4 31.98,82.22 v31.95,82.25 | v14.8,78.65 14.8,78.8
  Top 0.254: 34.02,60.02 34,60 | IC2.26 38.72,71.27 37.95,70.5 35.2,70.5 34.85,70.85 U$1.1 | v7.4,67.9 7.4,65.05 v7.3,64.9 | v4.35,71.3 3.9,71.3 2.4,72.75 1.3,72.75 0.45,73.6 0.45,77.2 0.45,86.7 1.35,87.6 3.85,87.6 4.3,87.15 4.3,86.25 LED1.A 5.55,84.9 8.1,84.9 8.95,85.75 13.4,85.75 14.25,84.9 16.4,84.9 16.75,85.25 LED2.A 17.5,85.15 R4.2 | TP2.TP 23.9,53.15 | IC14.1 70.75,13.5 v71.2,13.95 | IC14.19 71.7,10.25 v72,9.95 C95.2 C94.2 74.7,8.3 75,8 75,5.5 74.05,4.55 R80.2 R79.2 R78.2 | IC14.9 66.25,11.75 v65.85,12.15 C93.2 | U$11.5 68.5,22.35 68.3,22.55 | 68.3,22.55 66.4,22.55 66,22.15 R71.2 63,21.3 | C66.2 71,22.3 70.75,22.55 68.3,22.55 | 38.7,24.43 38.73,24.43 | C51.2 12.45,80.9 13.15,80.2 14.7,80.2 v14.8,80.15
  Top 0.305: R20.2 v27.7,55.05 C44.2 | IC2.40 43.67,65.28 v43.5,65.45 | IC2.47 47.17,65.38 v47,65.45 | IC2.56 51.67,65.17 v51.5,65.45 | IC2.62 54.67,65.53 v54.75,65.45 | IC2.81 60.42,70.27 v60.5,70.25 | IC2.93 60.52,76.27 v60.5,76.25 | IC2.26 41.38,71.27 v41.4,71.35 | IC2.17 41.23,75.77 v41.25,75.75 | IC2.139 44.67,84.72 v44.7,84.55 | IC2.130 49.17,84.62 v49.2,84.55 | IC2.122 53.17,84.67 v53.3,84.55 | IC2.117 55.67,84.58 v55.65,84.5 | v51.55,58.7 54.9,58.7 55.33,58.27 IC3.20 55.3,57.6 55.3,56.24 v55.35,56.25 | v49.7,58.7 v43.95,58.7 | IC4.20 43.94,58.96 v43.95,58.7 | 36.08,59.02 v36.05,58.7 | v36.05,58.7 36.45,58.3 41.95,58.3 42.35,58.7 v43.95,58.7 | 34.02,60.02 34.02,58.78 34.1,58.7 v36.05,58.7 | v57.45,55.7 62.3,55.7 62.75,56.15 66.05,56.15 66.7,55.5 v67.2,55.5 67.33,55.62 IC11.20 | R3.2 0.55,77.3 0.45,77.2 | 24.71,79.86 24.68,79.83 | IC10.20 36.08,58.73 v36.05,58.7 | C57.PLUS 23.84,87.94 23.5,87.6 | 73.36,74.41 v73.35,74.4 | LED6.A LED5.A LED4.A 83.65,63.25 82.65,64.25 81.25,64.25 v81.1,64.4 | v79.7,65.8 v79.7,69.95 79.95,69.95 80.75,70.75 82,70.75 | IC12.14 73.5,78.7 v73.35,78.85 | R38.2 82,70.75 | 82,70.75 82,69.8 C48.2 | v29.75,82.45 29.75,82.5 29.5,82.75 26,82.75 v25.7,82.45 | IC13.5 4.99,30.02 v4.95,30.05 4.8,30.2 C63.2 | U$8.B1 3.5,26.55 v3.65,26.7 3.45,26.5 1.5,26.5 1,27 1,33 8,40 v7.95,40.05 | U$2.B1 38.7,24.43 39,24.43 | 39,24.43 JP1.1 | R70.2 v39,23.75 39,24.43 | R69.2 12.8,35.25 13.45,35.9 13.45,37.25 12.95,37.7 | U$6.5 12.2,37.7 12.95,37.7 | C64.2 v12.85,40.05 12.95,39.9 12.95,37.7 | 60.93,24.43 L8.1 | C96.2 65.85,8.85 v66.1,9.1
  Top 0.406: SD1.4 v7.29,64.89 v7.3,64.9 | v10.7,64.9 13.5,64.9 v13.8,64.1 | IC7.8 15.21,55.95 C41.1 | C41.1 C40.1 15.65,55 C37.1 15.61,52.15 IC7.5 | C41.1 15.75,57.75 17.27,59.27 | U$1.4 v34.85,72.35 U$1.1 | v65.95,75 66.1,75 66.1,74.5 67.3,73.3 69.75,73.3 v70.55,72.5 70.6,72.45 C60.PLUS | v79.7,69.95 76.31,69.95 C49.2 76.05,70 IC9.8 72.5,70 72.3,70 71.9,70.4 71.9,72.41 C60.PLUS | v73.35,74.4 72.55,74.4 71.95,73.8 C60.PLUS | U$5.B1 32.32,90.45 | v25.2,87.7 29.57,87.7 U$7.1 | U$10.B1 60.93,24.43 60.93,22.93 C65.PLUS 62.65,22.36 63,22 63,21.3 v63,18.65
  Top 0.61: v23.9,54.9 23.9,53.15 24.2,52.85 30.85,52.85 34,55.95 34,60 34,62.75 34.2,62.95 v38.95,62.95 | v23.9,54.9 C46.2 | v39.75,62.95 v38.95,62.95 | v38.95,62.95 v40.5,62.95 | v23.9,54.9 21.65,54.9 17.27,59.27 15.8,60.75 v15.8,64.1 15.8,69.25 18.7,72.15 19.9,72.15 20.85,73.1 20.85,74.15 20.85,76.85 22,78 22.85,78 24.68,79.83 25.7,80.85 v25.7,82.45 | v25.2,87.1 v25.2,87.7 25.1,87.6 23.5,87.6 21.9,89.2 v21.9,89.5 v21.25,89.5 | v43.5,67.05 v47,67.05 v51.5,67.05 v54.75,67.05 56.95,67.05 58.85,68.95 v58.85,70.25 v58.85,75 v58.85,76.25 v58.85,78.4 58.85,82.8 58.7,82.9 v55.65,82.9 v53.3,82.9 v49.2,82.9 v44.7,82.9 44.2,82.9 43.1,81.8 v43.1,75.75 v43.1,71.35 43.1,67.45 v43.5,67.05
  Top 1.27: 32.32,90.45 U$7.1
  Route2 0.254: v39,23.75 39.05,25.05 39,26.5 38,28 38,28.1 35.05,29.05 22.3,32 16.3,38 15.65,38 13.6,40.05 v12.85,40.05 | v63,18.65 63,17 55.5,17 52,20.5 52,24.5 48.5,28 48.5,27.2 JP1.1
  Route2 0.61: v4.95,30.05 10.25,35.35 10.25,51.25 11.25,52.25 11.25,55 9.5,56.75 9.5,57.8 v12,60.3
  Bottom 0.152: v60.45,78.4 v58.85,78.4 | 41.2,75.8 v41.25,75.75 | R24.1 43.45,59.2 C29.1 | R25.1 36.4,60 C24.1 | R26.1 55.3,57.3 C23.1 | v57.45,54.05 v57.45,55.7 | R27.2 45.8,82.95 44.75,82.95 v44.7,82.9 | v12,60.3 R28.1 8.75,60.3 U$4.1 | v23.05,74.15 v21.45,74.15 | U$4.4 6.45,61.8 5.92,62.33 | R32.2 6,65.2 R34.2 | v18.3,78.75 18.35,78.75 18.5,78.6 v18.5,77.4 | v14.8,80.15 v14.8,78.65
  Bottom 0.254: 41.2,75.8 R7.2 41.2,77.75 R6.2 | v4.35,71.3 4.35,70.95 6.2,69.1 7.1,69.1 7.4,68.8 v7.4,67.9 | 44.75,85.55 C11.1 | R30.2 5.6,62 5.92,62.33 6,62.4 R31.2 R32.2 v7.3,64.9 | v71.2,13.95 71.2,13.85 | v72,9.95 71.9,9.95 | v65.85,12.15 65.85,12.25
  Bottom 0.305: v23.9,54.9 27.55,54.9 v27.7,55.05 | v47,65.45 47,65.75 | v41.4,71.35 41.4,71.3 | v51.55,58.7 v49.7,58.7 | v57.45,55.7 55.9,55.7 v55.35,56.25 | 73.3,74.35 v73.35,74.4 | v81.1,64.4 v79.7,65.8 | v29.75,82.45 29.95,82.25 v31.95,82.25 32,82.2 R8.2 R9.2 | v3.65,26.7 3.65,28.75 v4.95,30.05 | v12.85,40.05 12.3,39.5 8.5,39.5 v7.95,40.05
  Bottom 0.406: v65.95,75 v58.85,75 | C23.1 v55.35,56.25 | C29.1 43.9,58.75 v43.95,58.7 | C24.1 v36.05,58.7 | v7.3,64.9 v10.7,64.9 | v13.8,64.1 v15.8,64.1 | C3.1 67.95,56.25 v67.2,55.5 | v21.89,89.5 v21.9,89.5 | C56.1 v34.85,72.35 | v73.35,74.4 v73.35,78.85 C52.1 | C53.1 73.3,74.35 | v66.1,9.1 66.1,10.3 | 66.1,10.3 66.1,11.9 v65.85,12.15 63,15 v63,18.65 | 71.2,13.85 71.65,13.85 72,13.5 v72,9.95 71.6,9.55 67.8,9.55 67.8,9.6 67.1,10.3 66.1,10.3
  Bottom 0.61: v51.5,67.05 v51.5,65.45 C16.1 | v54.75,67.05 v54.75,65.45 55.6,64.45 C19.1 | v47,67.05 v47,65.45 47,64.65 C13.1 47.2,64.8 47.1,64.9 | v58.85,70.25 v60.5,70.25 61.05,70.25 61.15,70.15 C25.1 | v58.85,76.25 v60.5,76.25 C30.1 | v43.1,71.35 v41.4,71.35 41.2,71.35 C6.1 | v43.1,75.75 v41.25,75.75 41.2,75.7 C5.1 | v44.7,82.9 v44.7,84.55 C11.1 | v49.2,82.9 v49.2,84.55 C15.1 | v53.3,82.9 v53.3,84.55 53.3,85.25 C17.1 | v55.65,82.9 v55.65,84.5 55.65,85.1 55.6,85.15 55.55,85.15 C20.1 | v40.5,62.95 40.5,64.85 42.45,66.8 43.25,66.8 v43.5,67.05 v43.5,65.45 43.5,64.8 43.65,64.65 C10.1 | v39.75,62.95 v40.5,62.95 | v38.95,62.95 v40.5,62.95 | U1.2 v21.89,89.5 | v25.2,87.7 v25.2,87.1 25.2,82.95 v25.7,82.45 v25.7,81.75
  pour Top (no thermals): 24.75,57.85 24.75,54.7 22.8,54.7 22.75,54.75 22.75,54.95 23.15,55.35 23.15,57.85
+5V  (via drill 0.3)
  Top 0.152: 21.95,72.75 22.75,73.55 23.3,73.55 23.45,73.7 31.65,73.7 32.85,72.45 32.85,68.6 v33.15,68.25 33.15,66.05 32.7,65.6 v32.7,65.1 | R12.2 32.4,58.9 33,59.5 33,62.2 v32.65,62.6 | Q3.4 72.85,54.45 72.95,54.35 72.95,51.75 73.15,51.55 74.1,51.55 Q5.2
  Top 0.254: R11.2 31.5,68.8 v31.8,68.25 | v69.3,54.65 69.55,54.4 70.65,54.4 71.05,54 R5.1 71.15,54.45 Q3.4 | Q4.4 66.9,53.3 R42.1
  Top 0.305: v18.95,58.7 18.75,58.7 16.45,61 16.45,69 18.95,71.5 20.7,71.5 21.95,72.75 22.1,72.9 22.1,76.55 22.25,76.7 IC8.1 23.05,77.3 26.4,80.65 26.4,81.8 v26.7,82.1 | v26.7,88.75 28.7,88.75 v30.65,90.7 | v18.95,56.05 18.95,51 v18.55,50.6
  Top 0.406: v54.4,52.75 56.65,55 57.75,55 57.9,55.15 62.85,55.15 64.35,53.65 v65.85,53.65 66.7,53.65 R42.1 | v49.5,55.85 45.15,55.85 v44.75,55.45 | v43.25,55.45 v36.8,55.45 | v35.5,55.45 35.2,55.45 31.05,51.3 21.65,51.3 20.95,50.6 v18.55,50.6 | v81,55 81.1,55 82.5,56.4 83.85,56.4 84.5,57.05 84.5,64.05 83.55,65 82.15,65 v82.05,65.1 | v80.35,66.75 80.35,68.95 v80.65,69.25 | v79.8,71.15 78.75,71.15 78.35,71.55 IC1.5 | v69.3,54.65 69.3,54.6
  Bottom 0.152: v33.15,68.25 v31.8,68.25 | v32.7,65.1 32.65,65.1 v32.65,62.6 | 18.55,50.65 v18.55,50.6
  Bottom 0.305: v18.95,56.05 v18.95,58.7 | v54.4,52.75 54.3,52.8 | U$5.A1 32.32,92.32 | v26.7,82.1 v26.7,88.75 | v30.65,90.7 30.7,90.7
  Bottom 0.406: 54.3,52.8 51.25,55.85 v49.5,55.85 | v44.75,55.45 v43.25,55.45 | v36.8,55.45 v35.5,55.45 | v81,55 69.65,55 v69.3,54.65 68.3,53.65 v65.85,53.65 | v82.05,65.1 82,65.1 v80.35,66.75 | v80.65,69.25 80.65,70.3 v79.8,71.15 | 32.32,92.32 30.7,90.7
  Bottom 0.6: 18.63,49.32 19.59,48.37 19.59,47.47 | v18.55,50.6 18.53,50.6
  Bottom 0.61: CONN1.A3 19.59,47.47 | 18.53,50.6 18.53,49.42 18.63,49.32
+9V  (via drill 0.3)
  Top 0.6: C31.2 17.85,69.45 17.15,68.75 17.15,61.25 18.9,59.5 v19.95,59.5
  Top 0.61: v19.95,51.35 v19.95,55.3
  Bottom 0.6: CONN1.A4 22.12,48.52 21.7,48.95 | v20.65,59.5 v19.95,59.5
  Bottom 0.61: v19.95,59.5 v19.96,59.49 v19.96,55.29 19.95,55.28 v19.95,55.3 | 21.7,48.95 19.96,50.69 v19.96,51.34 v19.95,51.35
  pour Top (no thermals): 19.7,60.95 19.7,59.25 20.9,59.25 20.9,59.75 21.8,60.2 21.8,60.95
  pour Top (no thermals): 21.9,61.9 22.5,61.9 22.55,61.65 23.1,61.1 24.5,61.1 24.8,60.8 24.8,60.4 25.05,60.15 25.75,60.15 25.75,60 23.35,60 23.1,60.25 21.9,60.25
  pour Top (no thermals): 18.2,70.15 19.2,71.05 24.45,71.05 24.75,70.75 24.75,70.35 25,70.1 25.7,70.1 25.7,69.95 20.75,69.95
A0  (via drill 0.3)
  Top 0.152: RN4.1 38.8,52.2 38.7,52.3 v38.7,52.75
  Bottom 0.152: v38.7,52.75 37.9,52.75 37,51.85 37,48.25 36.65,47.9 35.2,47.9 34.83,47.52 CONN1.A9
A1  (via drill 0.3)
  Top 0.152: RN4.2 40.12,51.77 39.9,51.6 38.5,51.6 v38.05,52.05
  Bottom 0.152: CONN1.A10 37.37,51.37 v38.05,52.05
A2  (via drill 0.3)
  Top 0.152: RN4.3 40.62,51.82 40.63,51.77 40.8,51.6 41.85,51.6 v42.05,51.8
  Bottom 0.152: CONN1.A11 39.91,47.35 39.95,46.66 | 39.7,46.8 39.95,46.66 | 39.95,46.66 39.9,47.55 40.1,47.75 41.5,47.75 42.05,48.3 v42.05,51.8
A3  (via drill 0.3)
  Top 0.152: v42.59,52.45 v42.6,52.45 42.5,52.55 41.75,52.55 41.4,52.2 RN4.4
  Bottom 0.152: v42.6,52.45 42.6,51.05 42.45,50.9 CONN1.A12
A4  (via drill 0.3)
  Top 0.152: RN5.4 77.22,49.16 v76.06,48.01
  Bottom 0.152: 72.92,47.16 72.97,46.87 73,47.8 73.2,48.01 v76.06,48.01
  Bottom 0.254: CONN1.A24 72.92,47.16
A5  (via drill 0.3)
  Top 0.152: v70.4,48.7 71.45,48.7 72.1,48.05 75.25,48.05 76.59,49.39 RN5.3
  Bottom 0.152: CONN1.A23 70.39,47.88 v70.4,48.7
A6  (via drill 0.3)
  Top 0.152: v68.7,48.75 69.05,48.75 69.55,49.25 71.35,49.25 72.2,48.4 75.15,48.4 76.09,49.34 RN5.2
  Bottom 0.152: CONN1.A22 67.84,47.9 v68.7,48.75
A7  (via drill 0.3)
  Top 0.152: v66.1,49.2 66.1,49.25 66.6,49.8 71.3,49.8 72.35,48.75 75.05,48.75 75.47,49.16 RN5.1
  Bottom 0.152: CONN1.A21 65.31,48.41 v66.1,49.2
A8
  Top 0.152: CONN1.B26 78,48.1 78.05,48.15 RN6.1
A9  (via drill 0.3)
  Top 0.152: RN6.2 78.67,48.73 v79,48.4
  Bottom 0.152: CONN1.A27 80.55,47.41 79.55,48.4 v79,48.4
A10
  Top 0.152: CONN1.B27 80.55,47.78 80.55,48.75 79.17,50.13 RN6.3
A11  (via drill 0.3)
  Top 0.152: RN6.4 79.8,50.2 80,50 81.95,50 v83.05,48.9
  Bottom 0.152: v83.05,48.9 83.05,47.84 CONN1.A28
A12  (via drill 0.3)
  Top 0.152: v18.1,48.3 24.4,48.3 25.35,49.25 31.95,49.25 33.95,51.24 RN3.4
  Bottom 0.152: CONN1.A2 17.05,47.45 17.9,48.3 v18.1,48.3
A13
  Top 0.152: CONN1.B2 17.05,48.26 17.64,48.84 24.3,48.84 25.1,49.65 31.8,49.65 34.02,51.87 RN3.3
A14  (via drill 0.3)
  Top 0.152: RN3.2 33.97,52.37 31.65,50.05 24.75,50.05 23.9,49.2 16.65,49.2 v15.85,48.4
  Bottom 0.152: 14.51,47.05 v15.85,48.4
  Bottom 0.254: CONN1.A1 14.51,47.05
A15
  Top 0.152: RN3.1 34.05,52.99 31.45,50.4 24.45,50.4 23.65,49.6 16.1,49.6 14.5,48 14.5,46.88 CONN1.B1
A_BUS_OE  (via drill 0.3)
  Top 0.152: 67.03,56.27 v66.85,56.3 | v64.1,60.15 63.7,60.15 60.65,63.2 60.65,64.85 59.45,66.05 v59.05,66.05 | v56.95,68.5 47.9,68.5 46.55,69.85 46.55,78.6 v45.9,79.25 | 41.25,79.25 v41.4,79.25 41.38,79.27 IC2.10 | v54.3,53.8 54.7,53.8 57.2,56.3 62.2,56.3 62.5,56.6 66.55,56.6 v66.85,56.3 | v37.05,56.55 44.05,56.55 v44.2,56.7 | v45.75,56.55 v50.05,56.55 | IC10.19 36.73,59.23 v37.05,58.95 | IC11.19 66.88,56.27 v66.85,56.3
  Bottom 0.152: v66.85,56.3 66.85,57.4 v64.1,60.15 | v59.05,66.05 59.05,66.4 v56.95,68.5 | v45.9,79.25 v41.4,79.25 | v44.2,56.7 45.55,56.7 v45.75,56.55 | v50.05,56.55 51.45,56.55 54.2,53.8 v54.3,53.8 | v37.05,56.55 v37.05,58.95 37.6,58.4 R25.2
AUDIO_L  (via drill 0.3)
  Top 0.305: v8.05,19 8.05,22.5 7,23.55 7,26.25 | 7,26.25 6.55,26.7 6.1,26.7 5.65,27.2 IC13.3 | R68.1 7,26.25
  Bottom 0.305: U$8.A6 7.48,11.98 8.05,12.55 v8.05,19
AUDIO_R  (via drill 0.3)
  Top 0.305: v7,19 7.45,19.45 7.45,22.35 6.5,23.3 6.5,25.8 6.5,25.85 6.15,26.2 4.65,26.2 4.35,26.5 IC13.1 4.3,27.7 R67.1
  Bottom 0.305: U$8.A5 6.52,14.52 7,15 v7,19
BLUE  (via drill 0.3)
  Top 0.406: R56.2 12,1.85 | 12,1.85 12.85,1.85 15.6,4.55 v15.6,6 15.6,15.9 X1.3 | R60.2 13.1,5.9 v13.25,6 | R50.2 10.7,20 11.5,19.2 v12.65,19.2 | R55.2 12,1.85
  Bottom 0.406: v13.25,6 v15.6,6 | v12.65,19.2 15.02,19.2 X1.3
BLUE0  (via drill 0.3)
  Top 0.406: R55.1 10.4,3.05 10.35,3.1 v6.4,3.1
  Bottom 0.305: 5.2,1.9 3.58,1.9 U$8.A10
  Bottom 0.406: v6.4,3.1 5.2,1.9
BLUE1
  Top 0.406: R56.1 3.53,1.85 U$8.B10
BLUE2  (via drill 0.3)
  Top 0.406: R60.1 10.4,5.9 10.1,5.6 v6.45,5.6
  Bottom 0.305: 5.15,4.3 3.56,4.3 U$8.A9
  Bottom 0.406: v6.45,5.6 5.15,4.3
BUF_L
  Top 0.305: R67.2 3.05,29.35 IC13.6 4.35,29.95 3.2,31.1 R64.2
BUF_R
  Top 0.305: R68.2 6.95,29.35 IC13.4 5.65,30.45 R61.2
CK  (via drill 0.3)
  Top 0.152: v34.4,48.1 35,48.7 36.8,48.7 37.45,49.35 44,49.35 45.7,51.05 v46,51.05 | RN1.1 55.45,49.8 55.15,50.1 52.95,50.1 52.6,49.75 50.05,49.75 v49.85,49.95
  Bottom 0.152: v46,51.05 48.75,51.05 v49.85,49.95 | CONN1.A8 32.28,46.84 32.3,47 33.4,48.1 v34.4,48.1
CLKIN
  Top 0.254: U$10.B4 64.86,16.81 66.1,18.05 69.2,18.05 R81.1
CONF_DONE  (via drill 0.3)
  Top 0.152: IC2.92 62.73,75.77 63,75.5 63,74.2 v63.1,74.1 | v57.95,74.1 57.45,74.6 57.45,78.05 53.9,81.6 45.6,81.6 v45.45,81.4 | v18.3,84.55 18.6,84.25 22.8,84.25 23.8,85.25 40.55,85.25 v41.9,83.9
  Bottom 0.152: v63.1,74.1 v57.95,74.1 | v41.9,83.9 44.35,81.45 45.4,81.45 v45.45,81.4 45.95,80.9 45.95,80.85 R27.1 | v18.3,84.55 18.3,83.6 18.75,83.15 U1.7
CTRL_OE  (via drill 0.3)
  Top 0.152: v51,60.4 52.3,59.1 55.1,59.1 55.95,58.24 IC3.19 55.95,55.85 v55.05,54.95 | v49.45,69.1 47.25,71.3 47.25,78.7 v50.1,81.05 | IC2.129 49.67,84.97 v50.1,84.55
  Bottom 0.152: v51,60.4 50.1,60.4 49.8,60.7 49.8,68.75 v49.45,69.1 | v50.1,84.55 v50.1,81.05 | v55.05,54.95 55,55 54.5,55 R26.2
D0
  Top 0.152: CONN1.B6 27.2,47.41 27.95,48.15 32.45,48.15 34.05,49.75 36.3,49.75 36.95,50.4 43.5,50.4 44.7,51.59 RN7.2
D1
  Top 0.152: CONN1.B7 29.75,47.3 30.25,47.8 32.65,47.8 34.25,49.4 36.45,49.4 37.1,50.05 43.65,50.05 45.2,51.59 RN7.3
D2
  Top 0.152: CONN1.B8 32.28,47.34 32.7,47.25 34.5,49.05 36.6,49.05 37.25,49.7 43.85,49.7 45.82,51.67 RN7.4
D3
  Top 0.152: RN8.3 48.03,51.28 46.55,49.8 45.8,49.8 44.3,48.3 40.55,48.3 39.91,47.66 CONN1.B11
D4
  Top 0.152: CONN1.B12 42.45,47.4 42.95,47.95 44.4,47.95 45.9,49.45 46.7,49.45 48.66,51.41 RN8.4
D5
  Top 0.152: 37.37,46.56 39.45,48.65 44.2,48.65 45.7,50.15 46.4,50.15 47.53,51.28 RN8.2
  Top 0.254: CONN1.B10 37.37,46.56
D6
  Top 0.152: CONN1.B9 34.5,46.2 34.5,47 35.8,48.3 36.95,48.3 37.65,49 44.1,49 45.6,50.5 46.25,50.5 46.91,51.16 RN8.1
D7
  Top 0.152: CONN1.B3 19.59,47.28 20.25,47.95 24.8,47.95 25.7,48.85 32.1,48.85 33.85,50.6 36.2,50.6 36.85,51.25 42.65,51.25 43.3,51.91 RN7.1
D_BUS_DIR  (via drill 0.3)
  Top 0.152: IC4.1 43.94,55.64 46.3,58 v48.8,58 | v48.8,67.85 47.1,67.85 45.35,69.6 45.35,77.45 v45.75,77.85 | IC2.11 41.08,78.77 v41.4,78.45
  Bottom 0.152: v48.8,58 v48.8,67.85 | v41.4,78.45 45.15,78.45 v45.75,77.85
D_BUS_OE  (via drill 0.3)
  Top 0.152: IC4.19 44.59,60.91 v44.45,61.05 | 45.4,67.95 v45.4,67.85 44.9,68.35 v44.9,80.65 | IC2.7 41.28,80.77 v41.4,80.65
  Bottom 0.152: v45.4,67.85 45.05,67.5 45.05,61.65 v44.45,61.05 44.2,60.8 R24.2 | v41.4,80.65 v44.9,80.65
DM  (via drill 0.3)
  Top 0.152: 77.85,82.55 TV26.3 78.05,82.5 | R36.2 77.6,80.75 v77.4,80.95 77.45,81 77.5,81
  Top 0.305: TV26.3 78,81.5 77.5,81 | R43.2 78.05,82.5
  Bottom 0.152: v77.4,80.95 77.1,81.25 77.1,87.88 USB2.D-
DP  (via drill 0.3)
  Top 0.152: R35.2 76.25,79.03 76.25,80.75 v76.45,80.95 | TV26.2 75.2,82.55
  Top 0.305: TV26.2 75.8,81.6 v76.45,80.95 | 75.2,82.55 74.15,82.55 R57.2
  Bottom 0.152: v76.45,80.95 76.75,81.25 76.75,87.03 USB2.D+
ESP_EN  (via drill 0.3)
  Top 0.152: v23.35,81.2 23.05,81.2 22.2,80.35 15.8,80.35 v15.8,80.55 15.25,80.55 14.03,81.78 S1.B2 13.22,82.3 C1.2 | v17.65,90.75 R2.1 | U$3.1 15.6,79.2 v15.8,79.4
  Bottom 0.152: v23.35,81.2 23.35,86.95 22.07,88.22 U1.3 19.48,88.22 19.05,88.65 19.05,89.7 v17.65,90.75 | v15.8,79.4 v15.8,80.55
ESP_IO0  (via drill 0.3)
  Top 0.152: v1.1,74.25 2.45,74.25 3.35,75.15 | 3.35,75.15 3.95,75.75 3.95,76.65 4.5,77.2 v4.5,78.45 4.5,81.72 S2.B2 | C2.2 2.8,75.7 3.35,75.15 | U$3.3 7.55,79.2 v6.7,78.35
  Top 0.305: R3.1 1.3,74.55 v1.1,74.25
  Bottom 0.152: U1.25 v1.1,74.25 | v6.7,78.35 4.65,78.35 v4.5,78.45
ESP_IO26  (via drill 0.3)
  Top 0.152: IC2.138 45.17,87.03 44.75,87.45 40.5,87.45 39.35,86.3 23.1,86.3 v22.6,86.8
  Bottom 0.152: v22.6,86.8 21.9,86.8 21.65,86.55 21.65,78.45 21.3,78.1 20.27,78.1 U1.11
ESP_IO27  (via drill 0.3)
  Top 0.152: IC2.141 43.67,86.58 43.15,87.1 40.7,87.1 39.55,85.95 22.3,85.95 v22.2,86.05
  Bottom 0.152: U1.12 21.14,76.8 22,77.65 22,85.95 v22.2,86.05 22.05,86
ESP_MISO  (via drill 0.3)
  Top 0.152: v6,83.55 6.2,83.7 15.2,83.7 16.1,82.8 23.15,82.8 24.2,83.85 37.4,83.85 38.75,82.5 38.75,81.55 39.03,81.27 IC2.6
  Bottom 0.152: v6,83.55 4.9,83.55 3.25,81.9 2.27,81.9 U1.31
ESP_MOSI  (via drill 0.3)
  Top 0.152: v3.45,89.5 18.95,89.5 20.55,87.9 20.55,85.65 20.8,85.4 v22.7,85.4 | v22.7,82.2 23,82.2 24.3,83.5 37.15,83.5 37.9,82.75 37.9,79.9 37.95,79.85 37.95,78.2 38.38,77.77 IC2.13
  Bottom 0.152: v3.45,89.5 U1.37 | v22.7,85.4 v22.7,82.2
ESP_NCS0  (via drill 0.3)
  Top 0.152: IC2.3 39.13,82.77 37.7,84.2 24.1,84.2 23.05,83.15 16.25,83.15 15.3,84.1 5.6,84.1 5.45,83.95 5.45,83.3 6.05,82.7 6.05,79.85 v6.55,79.35
  Bottom 0.152: v6.55,79.35 2.25,79.35 U1.29
ESP_QDH  (via drill 0.3)
  Top 0.152: IC2.1 39.33,83.77 38.15,84.9 23.9,84.9 22.85,83.85 17.65,83.85 16.95,84.5 v3.5,84.5
  Bottom 0.152: v3.5,84.5 2.33,84.5 U1.33
ESP_QWP  (via drill 0.3)
  Top 0.152: v3.45,88.25 4.35,89.15 18.8,89.15 20.2,87.75 20.2,85.3 20.7,84.8 22.9,84.8 23.7,85.6 40.75,85.6 41.75,84.65 42.55,84.65 42.67,84.78 IC2.143
  Bottom 0.152: v3.45,88.25 2.27,88.25 U1.36
ESP_RX  (via drill 0.3)
  Top 0.152: IC7.6 11.63,53.41 11.35,53.7 11.35,56.2 15.25,60.1 15.25,71.4 15.5,71.65 15.5,75 14.75,76.05 12.3,76.05 | 12.3,76.05 7.85,76.05 5.6,78.25 5.6,82.7 5,83.3 3.8,83.3 2.65,84.45 2.65,84.95 v3.4,85.7 | U$3.6 12.25,76.1 12.3,76.05
  Bottom 0.152: v3.4,85.7 2.25,85.7 U1.34
ESP_SCK  (via drill 0.3)
  Top 0.152: v26.05,79.05 26.55,79.05 30.25,75.35 36.85,75.35 | 36.85,75.35 37,75.35 38.3,74.05 38.3,73.15 38.68,72.77 IC2.23 | v6.65,80.6 7.3,79.95 12.7,79.95 13.05,79.6 15.2,79.6 15.55,79.95 17.85,79.95 18.6,79.2 22.35,79.2 v23.05,79.9 | IC2.12 38.73,78.27 v38.55,78.5 | v36.85,75.15 36.85,75.35
  Bottom 0.152: v6.65,80.6 U1.30 | v26.05,79.05 23.9,79.05 v23.05,79.9 | v38.55,78.5 38.5,78.5 37.95,77.95 37.95,76.3 v36.85,75.15
ESP_TX  (via drill 0.3)
  Top 0.152: IC7.7 12.27,54.69 11.95,55 v11.95,55.8 | v11.35,57.05 11.35,57.15 14.85,60.65 14.9,71.6 15.1,71.8 15.1,74.85 14.85,75.1 14.35,75.7 7.45,75.7 5.25,77.9 5.25,82.6 4.9,82.95 3.65,82.95 2.3,84.3 2.3,85.85 v3.4,86.95
  Bottom 0.152: v11.95,55.8 11.95,56.45 v11.35,57.05 | v3.4,86.95 U1.35
ETH_CLK
  Top 0.254: IC14.5 68.75,13.9 69.15,14.3 69.15,16 R81.2
ETH_CRS_DV
  Top 0.254: IC14.11 61.35,10.75 60.3,9.7 57.51,9.7 U$10.B7
ETH_MDC  (via drill 0.3)
  Top 0.152: R79.1 69.9,3.15 v69.3,3.75 | v66.15,7.2 66.1,7.2
  Top 0.254: IC14.13 68.25,9.35 66.17,7.28 66.1,7.2 65.95,7.05 v60.05,7.05
  Bottom 0.152: v69.3,3.75 69.3,4.05 v66.15,7.2
  Bottom 0.254: v60.05,7.05 57.4,7.05 U$10.A8
ETH_MDIO  (via drill 0.3)
  Top 0.152: R80.1 v70.2,4.55 | v67.05,9.35 67.05,10.05 66.85,10.25
  Top 0.254: IC14.12 66.85,10.25 61.75,10.25 v60.5,9
  Bottom 0.152: v70.2,4.55 70.2,6.2 v67.05,9.35
  Bottom 0.254: v60.5,9 57.19,9 U$10.A7
ETH_NRST  (via drill 0.3)
  Top 0.152: R78.1 68.5,1.75 v67.85,2.4
  Top 0.254: v60.2,4.8 65.4,4.8 v65.5,4.8 65.75,4.8 69.25,8.3 IC14.15
  Bottom 0.152: v67.85,2.4 v65.5,4.8
  Bottom 0.254: v60.2,4.8 57.81,4.8 U$10.A9
ETH_REF_CLK
  Top 0.254: IC14.14 68.75,8.75 66.5,6.5 66.3,6.3 59.35,6.3 59.15,6.5 57.15,6.5 U$10.B8
ETH_RXD0
  Top 0.254: IC14.8 66.7,12.25 65.9,13.05 61.05,13.05 60.25,12.25 57.52,12.25 U$10.B6
ETH_RXD1
  Top 0.254: IC14.7 66.9,12.75 65.4,14.25 57.02,14.25 U$10.B5
ETH_RXERR  (via drill 0.3)
  Top 0.254: IC14.10 v60.15,11.25
  Bottom 0.254: v60.15,11.25 57.48,11.25 U$10.A6
ETH_TX_EN
  Top 0.254: U$10.B9 57.11,4 66,4 69.75,7.75 IC14.16
ETH_TXD0  (via drill 0.3)
  Top 0.254: v60.1,2.15 65.75,2.15 70.25,6.65 IC14.17
  Bottom 0.254: U$10.A10 59.52,1.57 v60.1,2.15
ETH_TXD1
  Top 0.254: 57.43,2 U$10.B10 57.07,1.5 66,1.5 70.75,6.25 IC14.18
ETHID  (via drill 0.3)
  Top 0.152: U$11.3 69.45,20.75 69.3,20.9 67.2,20.9 R71.1
  Top 0.254: v60.4,17.7 64.35,17.7 66,19.35 R71.1
  Bottom 0.254: U$10.A4 59.51,16.81 v60.4,17.7
EXT0
  Top 0.152: IC2.135 46.67,87.58 46.4,87.85 39.9,87.85 U$7.3 37.45,90.5 38,90.5 39.94,92.44 U$5.B4
EXT1
  Top 0.152: IC2.133 47.67,87.97 47.45,88.2 42.09,88.2 U$7.4 42.48,92.99 U$5.B5
EXT2
  Top 0.152: U$5.B6 45.02,92.99 U$7.5 44.28,88.55 49.9,88.55 50.17,88.28 IC2.128
EXT3
  Top 0.152: U$5.B7 47.56,92.99 U$7.6 46.47,88.9 50.35,88.9 50.67,88.58 IC2.127
EXT4
  Top 0.152: IC2.126 51.17,88.58 50.5,89.25 48.66,89.25 U$7.7 50.1,92.99 U$5.B8
EXT5
  Top 0.152: IC2.125 51.67,88.78 U$7.8 52.64,92.99 U$5.B9
EXT6
  Top 0.152: U$5.B10 55.18,92.99 U$7.9 52.17,89.98 IC2.124
EXT7
  Top 0.152: IC2.121 53.67,88.92 54.55,89.8 55.1,90.37 U$7.10
  Bottom 0.152: U$5.A10 55.18,90.45 U$7.10
EXT8  (via drill 0.3)
  Top 0.152: IC2.114 57.17,88.17 v55.95,89.4
  Bottom 0.152: v55.95,89.4 54.25,89.4 53.85,89.8 53.85,90.65 52.55,91.95 52.55,94.66 U$5.A9
EXT9  (via drill 0.3)
  Top 0.152: IC2.115 56.67,87.92 56.25,88.35 v56.05,88.5
  Bottom 0.152: v56.05,88.5 55.5,89.05 53.8,89.05 53.45,89.4 51.8,89.4 51.3,89.9 51.3,90.85 50.1,92.05 U$5.A8
EXT10  (via drill 0.3)
  Top 0.152: IC2.119 54.67,86.97 55.1,87.4 v55.1,88.45
  Bottom 0.152: v55.1,88.45 54.85,88.7 53.7,88.7 53.35,89.05 51.05,89.05 50.7,89.4 49.1,89.4 48.8,89.7 48.8,90.75 47.6,91.95 47.6,94.71 U$5.A7
EXT11  (via drill 0.3)
  Top 0.152: IC2.120 54.17,88.17 v54.25,88.1
  Bottom 0.152: v54.25,88.1 53.8,88.1 53.25,88.7 50.9,88.7 50.55,89.05 46.95,89.05 46.25,89.75 46.25,90.7 45,91.95 45,94.73 U$5.A6
EXT12  (via drill 0.3)
  Top 0.152: IC2.142 43.17,86.62 43.05,86.75 41.45,86.75 v41.4,86.55 | v42.55,88.75 42.25,88.75 41.2,89.8 41.2,90.6 v42.35,91.75
  Bottom 0.152: v41.4,86.55 41.4,87.6 v42.55,88.75 | v42.35,91.75 42.35,94.62 U$5.A5
EXT13  (via drill 0.3)
  Top 0.152: IC2.144 41.04,85.76 v40.65,86.15 | v40.65,88.4 40.15,88.4 38.75,89.8 38.75,90.75 39.65,91.65 39.85,91.65 v40.15,91.75
  Bottom 0.152: v40.65,86.15 v40.65,88.4 | v40.15,91.75 40,91.9 40,94.69 U$5.A4
EXTID  (via drill 0.3)
  Top 0.305: v39,17.55 R70.1
  Bottom 0.305: JP1.8 48.24,16.81 46.95,18.1 39.55,18.1 v39,17.55 38.26,16.81 U$2.A4
FLED0
  Top 0.152: IC2.76 62.73,67.77 63.85,66.65 63.85,64.75 66.65,61.95 75.4,61.95 78.4,58.95 R41.2
FLED1
  Top 0.152: IC2.77 62.73,68.27 64.2,66.8 64.2,64.9 66.8,62.3 76.15,62.3 78.1,60.35 R40.2
FLED2
  Top 0.152: IC2.80 62.53,69.77 64.55,67.75 64.55,65.05 66.95,62.65 76.7,62.65 77.6,61.75 R39.2
FORCE_INT
  Top 0.152: IC2.53 50.17,61.42 50.35,61.25 50.35,58.25 51.6,57 51.6,56.45
  Top 0.254: 51.6,56.45 Q2.1
FORCE_IORQULA  (via drill 0.3)
  Top 0.152: IC2.136 46.17,84.67 v46.35,84.5 | v49.4,79.75 49.95,79.2 53.3,79.2 55.15,77.35 55.15,71.2 56.65,69.7 v56.65,69.3 | v59.6,66.65 59.6,66.4 61.05,64.95 61.05,63.7 v62.9,61.85 | Q4.2 69.1,52.65 68.75,53 68.75,54.3 68.45,54.6 65.05,54.6 64.65,55 v64.65,55.5
  Bottom 0.152: v46.35,84.5 46.35,84.15 46.5,84 47.1,84 47.5,83.6 47.5,81.65 v49.4,79.75 | v56.65,69.3 56.95,69.3 v59.6,66.65 | v64.65,55.5 64.65,55.9 62.65,57.9 62.65,61.6 v62.9,61.85
FORCE_NMI  (via drill 0.3)
  Top 0.152: IC2.137 45.67,84.67 v45.55,84.55 | v47.35,81 47.35,79.4 46.9,78.95 46.9,70.6 v48.25,69.25 | v50.95,59.6 50.85,59.35 50.85,58.4 51.8,57.45 52.25,57.45 52.55,57.15 52.55,53.85 52.75,53.65 Q6.1
  Bottom 0.152: v45.55,84.55 45.55,84.25 46.2,83.6 46.75,83.6 47.1,83.25 47.1,81.25 v47.35,81 | v48.25,69.25 49.4,68.1 49.4,60.25 50.1,59.55 50.75,59.55 v50.95,59.6
FORCE_RESET  (via drill 0.3)
  Top 0.152: IC2.67 57.17,62.83 61.75,58.25 | v61.8,54.4 Q1.1
  Top 0.254: 61.75,58.25 61.75,56.85 v61.8,56.85
  Bottom 0.254: v61.8,56.85 v61.8,54.4
FORCE_ROMCS  (via drill 0.3)
  Top 0.152: IC2.132 48.17,84.58 v48.2,84.55 | v50.55,79.95 53.05,79.95 55.5,77.5 55.5,71.35 v57.7,69.35 | v60.3,67.15 60.3,66.15 61.4,65.05 61.4,64.3 63.65,62.05 v63.65,61.35 | Q3.2 73.4,53.8 73.3,53.9 73.3,54.8 72.85,55.25 69.05,55.25 68.75,54.95 66.05,54.95 v65.5,55.5
  Bottom 0.152: v48.2,84.55 48.2,81.75 50,79.95 v50.55,79.95 | v60.3,67.15 59.9,67.15 v57.7,69.35 | v65.5,55.5 63,58 63,60.7 v63.65,61.35
FR1
  Top 0.152: Q5.1 74,49.6 73.05,50.55 73.05,51.15 72.4,51.8 72.4,52 71.95,52.45
  Top 0.254: R5.2 71.95,52.45 72.3,52.8 Q3.6 Q3.5
FR2
  Top 0.254: R42.2 66.8,52 Q4.6 Q4.5
GND  (via drill 0.3)
  Top 0.152: v52.45,73.5 IC2.145
  Top 0.254: C1.1 v10.5,81.6 C51.1
  Top 0.305: IC2.140 44.17,84.88 v43.9,84.55 | IC2.131 48.67,86.67 v48.25,87.05 | IC2.123 52.67,84.78 52.65,84.75 52.3,84.6 52.08,84.67 v52.4,84.55 | IC2.118 55.17,84.92 v54.8,84.55 | IC2.108 61.66,84.19 v61.65,84.25 | IC2.95 60.63,77.27 v60.45,77.05 60.45,77.65 60.57,77.77 IC2.96 | IC2.79 60.63,69.27 v60.5,69.4 | IC2.82 60.83,70.77 v60.45,71.15 | IC2.63 55.17,63.12 v55.05,63 | IC2.57 52.17,65.38 v52.3,65.45 | IC2.48 47.67,65.22 v47.8,65.45 | IC2.41 44.17,65.33 v44.3,65.45 | IC2.4 41.02,82.27 v41.4,82.55 | IC2.19 41.28,74.77 v41.35,74.7 | IC2.27 41.18,70.77 v41.4,70.55 | IC2.36 40.19,65.89 v40,65.7 | SD1.MNT1 10.68,68.47 v10.6,68.4 | IC2.21 39.22,73.77 v38.85,73.4 38.98,73.27 IC2.22 | IC3.10 61.89,51.74 v61.95,51.8 62.64,51.11 Q1.2 | Q2.2 50.39,54.39 v50.35,54.35 50.17,54.17 IC4.10 | 25.52,68.72 IC5.4 | S3.A2 15.1,86.15 v14.25,87 | S2.A2 v8.75,80.75 | S1.A2 18.18,81.78 17.75,81.35 v17.25,81.3 17.25,81.4 v15.6,81.4 | C2.1 v3.5,77.35 3.6,77.45 v3.55,78.7 | Q4.1 69.25,52 v68.7,51.45 | Q3.1 v74,52.55 | IC11.10 74.88,61.48 v74.95,61.4 | Q6.2 49.95,52.95 v49.8,53.1 | IC10.10 41.92,53.17 v42,53.1 | v32.85,56.05 32.85,56.95 C58.1 | R23.2 v7.05,49.65 | IC1.2 82,74 v82.15,73.85 | IC13.2 5,26.9 v5.05,26.85 | C63.1 v4,32.7 | R65.2 v5.85,36.5 | C61.1 v7.35,36.5 | R63.2 v12.05,26.75 | R62.2 v11.55,25.7 | C54.1 v8.2,25.7 | R50.1 v10.7,24.1 | R49.1 v12.2,24.1 | R48.1 v13.7,24.1 | R66.2 v11.25,33.25 | C101.2 v60.8,37.95 | C100.2 v58.1,32.4 | v68.95,10.95 IC14.P